# EAGLE schematic remote_2313_4313-1wire (EAGLE 7.6.0)
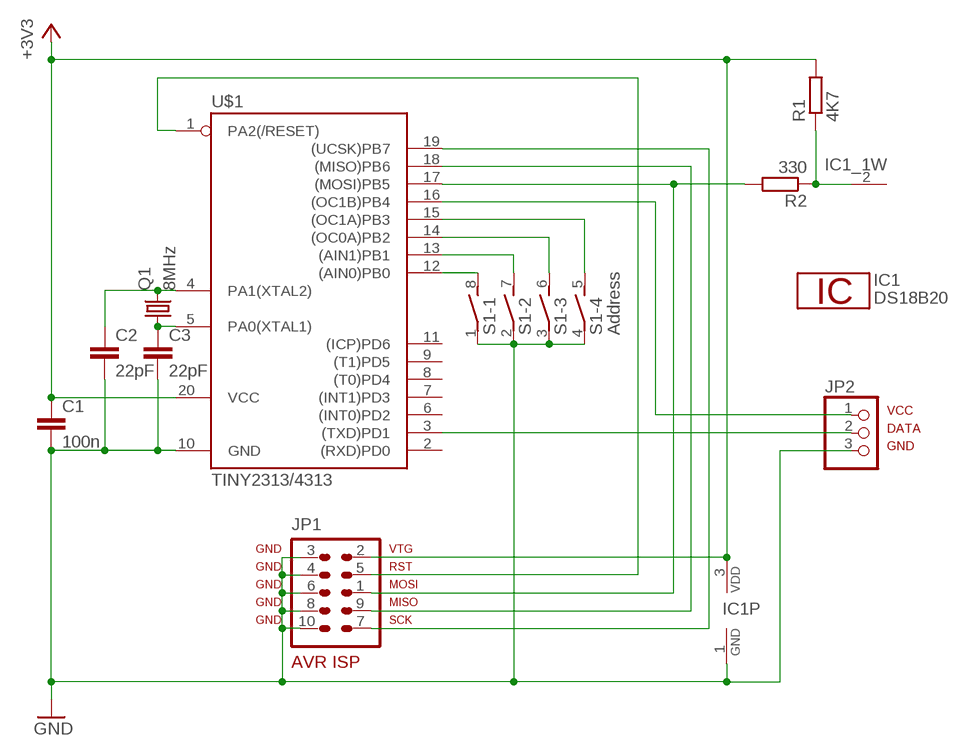
[diagram p0: schematic, sheet 1]

## Parts
C1  100n  C-EU025-025X050  [C025-025X050]
C2  22pF  C-EU025-024X044  [C025-024X044]
C3  22pF  C-EU025-024X044  [C025-024X044]
IC1  DS18B20  [TO92-]
JP1  AVR-ISP-10  [AVR-ISP-10]
JP2  PINHD-1X3  [1X03]
Q1  8MHz  CRYSTALHC49U-V  [HC49U-V]
R1  4K7  R-EU_0204/5  [0204/5]
R2  330  R-EU_0204/5  [0204/5]
S1  Address  DIP04S  [DIP04S]
U$1  TINY2313/4313  TINY2313-*P*  [DIL20]

## Nets
+3V3: C1.1 IC1.3 JP1.2 R1.2 U$1.20(VCC)
GND: C1.2 C2.2 C3.2 IC1.1 JP1.3 JP1.4 JP1.6 JP1.8 JP1.10 JP2.3 S1.1 S1.2 S1.3 S1.4 U$1.10(GND)
N$1: S1.8 U$1.12((AIN0)PB0)
N$2: S1.7 U$1.13((AIN1)PB1)
N$3: S1.6 U$1.14((OC0A)PB2)
N$4: S1.5 U$1.15((OC1A)PB3)
N$5: JP2.1 U$1.16((OC1B)PB4)
N$6: JP1.1 R2.2 U$1.17((MOSI)PB5)
N$7: JP2.2 U$1.3((TXD)PD1)
N$8: JP1.7 U$1.19((UCSK)PB7)
N$9: JP1.9 U$1.18((MISO)PB6)
N$10: JP1.5 U$1.1(PA2(/RESET))
N$11: C3.1 Q1.1 U$1.5(PA0(XTAL1))
N$12: IC1.2 R1.1 R2.1
N$13: C2.1 Q1.2 U$1.4(PA1(XTAL2))
Unconnected: U$1.2((RXD)PD0) U$1.6((INT0)PD2) U$1.7((INT1)PD3) U$1.8((T0)PD4) U$1.9((T1)PD5) U$1.11((ICP)PD6)

## Notes on the sheet
- VCC
  DATA
  GND

## Library data of the parts
C1-C3 = rcl:C-EU: CAPACITOR, European symbol
IC1 = 1wire:DS18B20: Programmable Resolution Digital Thermometer This chip provides a onewire thermosensor with approx. 0.5°C accuracy. A programmable over/undertemperure alarm is available. The precision can be set from 9..12 bits. Notes: Vdd must be applied for accurate measurements at low temperatures, as the parasite power circuit otherwise heats the sensor. If parasite power is used, Vdd has to be connected to GND. The DS1822 is a low-cost thermometer chip, the DS18S20 is similar to the DS18B20, but with 9 Bit precision only. Author: Jan Kandziora <jjj@gmx.de>
JP1 = avr-7:AVR-ISP-10: AVR ISP-10 Serial Programming Header
JP2 = pinhead:PINHD-1X3: PIN HEADER
Q1 = crystal:CRYSTAL: CRYSTAL; OC_FARNELL: 1666969; OC_NEWARK: unknown
R1 R2 = rcl:R-EU_: RESISTOR, European symbol
S1 = switch-dil:DIP04S: DIL/CODE SWITCH; OC_FARNELL: unknown; OC_NEWARK: unknown
U$1 = avr-7:TINY2313*: Atmel Tiny2313 2K Flash, 128 bytes EEPROM, 128 bytes RAM